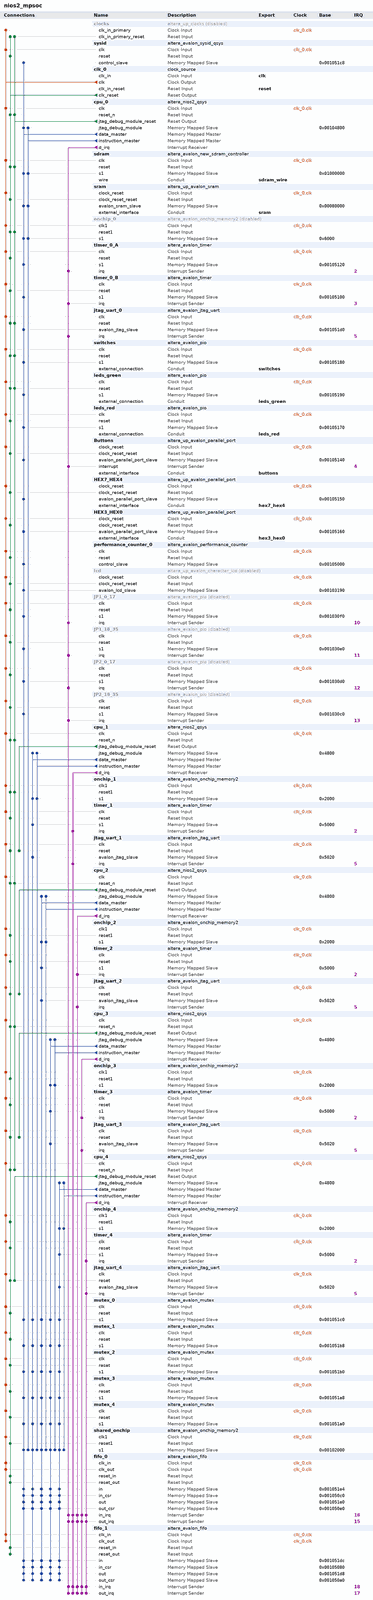
[diagram p0: system contents, whole]
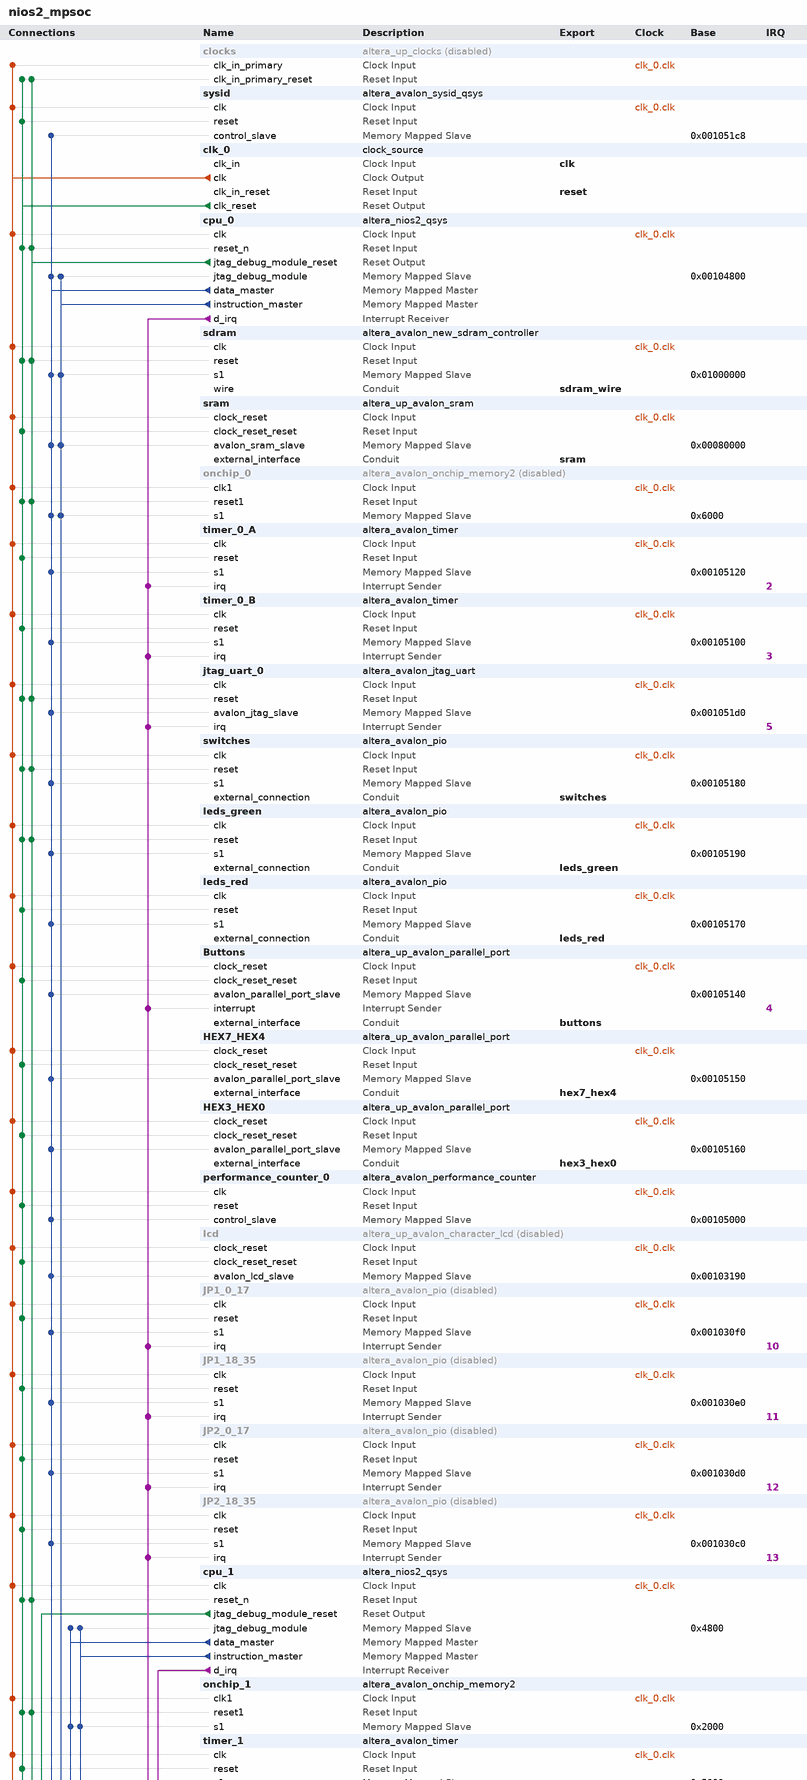
[diagram p1: system contents, upper part]
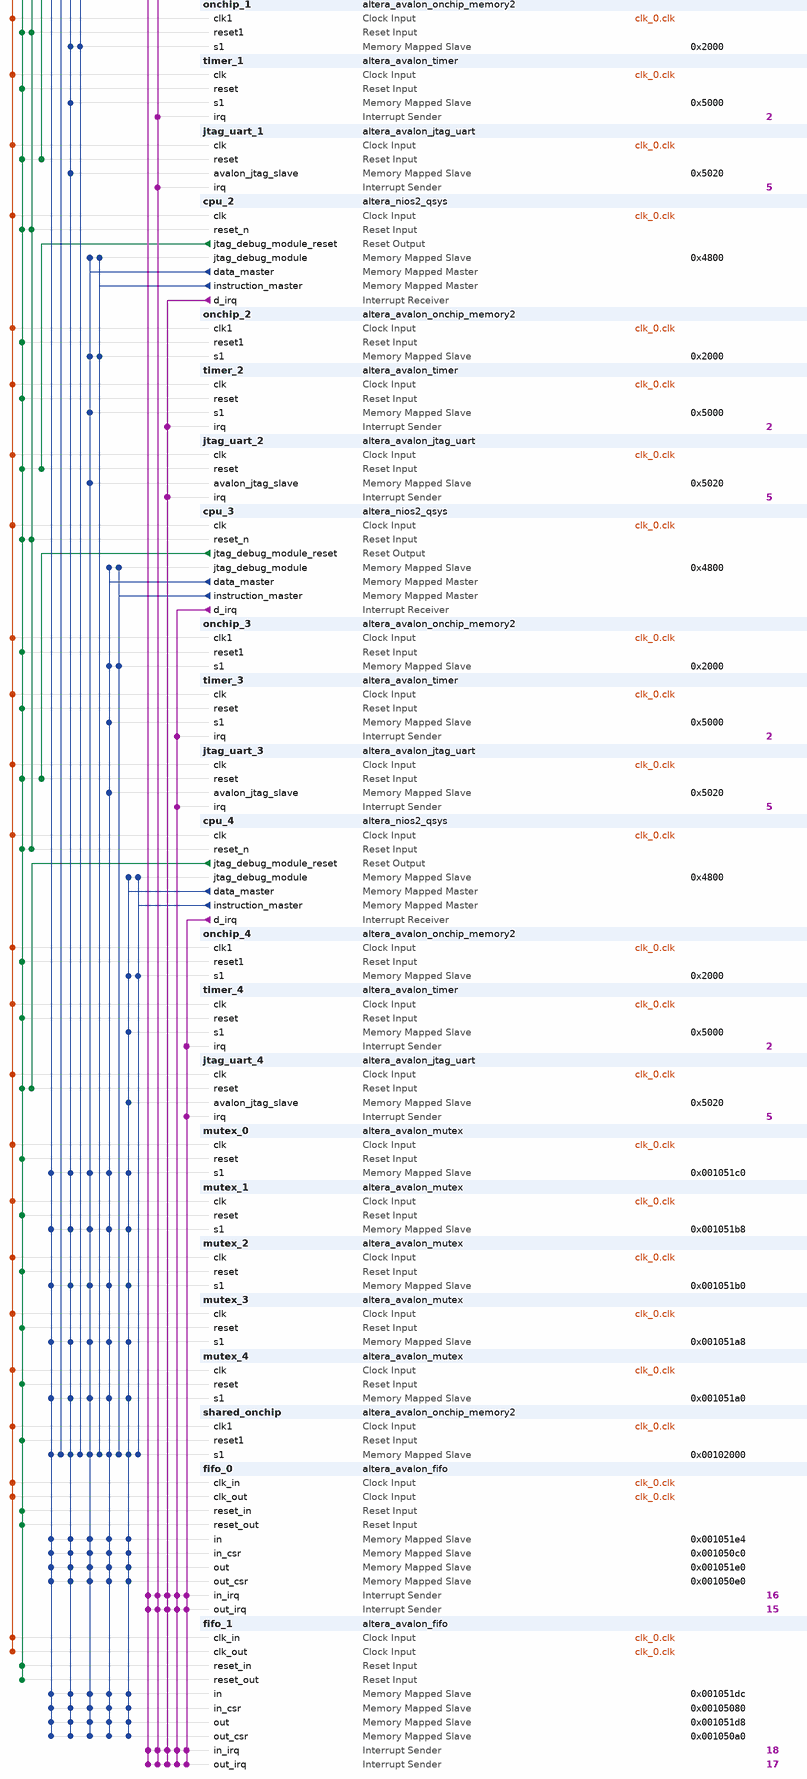
[diagram p2: system contents, lower part]
# Platform Designer (Qsys) system nios2_mpsoc, Cyclone IV E EP4CE115F29C7
# Parameters at their usual value, and those the tool derives, are not listed.
package require -exact qsys 13.0.1.99.2
create_system nios2_mpsoc
set_project_property DEVICE_FAMILY {Cyclone IV E}
set_project_property DEVICE EP4CE115F29C7

add_instance clocks altera_up_clocks 13.0
set_instance_property clocks ENABLED false
set_instance_parameter_value clocks board DE2
set_instance_parameter_value clocks vga_clk false
set_instance_parameter_value clocks audio_clk false
set_instance_parameter_value clocks audio_clk_freq 12.288

add_instance sysid altera_avalon_sysid_qsys 13.0
set_instance_parameter_value sysid id 538186246

add_instance clk_0 clock_source 13.0
set_instance_parameter_value clk_0 clockFrequency 50000000

add_instance cpu_0 altera_nios2_qsys 13.0
set_instance_parameter_value cpu_0 resetSlave sram.avalon_sram_slave
set_instance_parameter_value cpu_0 mmu_TLBMissExcSlave None
set_instance_parameter_value cpu_0 exceptionSlave sram.avalon_sram_slave
set_instance_parameter_value cpu_0 breakSlave cpu_0.jtag_debug_module
set_instance_parameter_value cpu_0 impl Tiny
set_instance_parameter_value cpu_0 icache_size 4096

add_instance sdram altera_avalon_new_sdram_controller 13.0.1.99.2
set_instance_parameter_value sdram TAC 5.5
set_instance_parameter_value sdram TRCD 20.0
set_instance_parameter_value sdram TRP 20.0
set_instance_parameter_value sdram casLatency 3
set_instance_parameter_value sdram columnWidth 8
set_instance_parameter_value sdram dataWidth 16
set_instance_parameter_value sdram generateSimulationModel false
set_instance_parameter_value sdram model single_Micron_MT48LC4M32B2_7_chip
set_instance_parameter_value sdram numberOfBanks 4
set_instance_parameter_value sdram numberOfChipSelects 1
set_instance_parameter_value sdram powerUpDelay 100.0
set_instance_parameter_value sdram refreshPeriod 15.625
set_instance_parameter_value sdram rowWidth 12

add_instance sram altera_up_avalon_sram 13.0
set_instance_parameter_value sram board DE2
set_instance_parameter_value sram pixel_buffer false

add_instance onchip_0 altera_avalon_onchip_memory2 13.0.1.99.2
set_instance_property onchip_0 ENABLED false
set_instance_parameter_value onchip_0 dataWidth 32
set_instance_parameter_value onchip_0 dualPort false
set_instance_parameter_value onchip_0 initMemContent true
set_instance_parameter_value onchip_0 initializationFileName onchip_mem.hex
set_instance_parameter_value onchip_0 memorySize 8192

add_instance timer_0_A altera_avalon_timer 13.0.1.99.2
set_instance_parameter_value timer_0_A period 1
set_instance_parameter_value timer_0_A periodUnits MSEC

add_instance timer_0_B altera_avalon_timer 13.0.1.99.2
set_instance_parameter_value timer_0_B period 1
set_instance_parameter_value timer_0_B periodUnits MSEC

add_instance jtag_uart_0 altera_avalon_jtag_uart 13.0.1.99.2
set_instance_parameter_value jtag_uart_0 simInteractiveOptions NO_INTERACTIVE_WINDOWS
set_instance_parameter_value jtag_uart_0 useRegistersForReadBuffer true
set_instance_parameter_value jtag_uart_0 useRegistersForWriteBuffer true

add_instance switches altera_avalon_pio 13.0.1.99.2
set_instance_parameter_value switches direction Input
set_instance_parameter_value switches width 18

add_instance leds_green altera_avalon_pio 13.0.1.99.2
set_instance_parameter_value leds_green direction Output
set_instance_parameter_value leds_green width 8

add_instance leds_red altera_avalon_pio 13.0.1.99.2
set_instance_parameter_value leds_red direction Output
set_instance_parameter_value leds_red width 18

add_instance Buttons altera_up_avalon_parallel_port 13.0
set_instance_parameter_value Buttons board DE2
set_instance_parameter_value Buttons preset Pushbuttons
set_instance_parameter_value Buttons capture true
set_instance_parameter_value Buttons edge Rising
set_instance_parameter_value Buttons irq true

add_instance HEX7_HEX4 altera_up_avalon_parallel_port 13.0
set_instance_parameter_value HEX7_HEX4 board DE2
set_instance_parameter_value HEX7_HEX4 preset {Seven Segment Displays}
set_instance_parameter_value HEX7_HEX4 sevensegs {7 to 4}
set_instance_parameter_value HEX7_HEX4 capture false
set_instance_parameter_value HEX7_HEX4 edge Rising
set_instance_parameter_value HEX7_HEX4 irq false

add_instance HEX3_HEX0 altera_up_avalon_parallel_port 13.0
set_instance_parameter_value HEX3_HEX0 board DE2
set_instance_parameter_value HEX3_HEX0 preset {Seven Segment Displays}
set_instance_parameter_value HEX3_HEX0 capture false
set_instance_parameter_value HEX3_HEX0 edge Rising
set_instance_parameter_value HEX3_HEX0 irq false

add_instance performance_counter_0 altera_avalon_performance_counter 13.0.1.99.2
set_instance_parameter_value performance_counter_0 numberOfSections 5

add_instance lcd altera_up_avalon_character_lcd 13.0
set_instance_property lcd ENABLED false
set_instance_parameter_value lcd cursor Both

add_instance JP1_0_17 altera_avalon_pio 13.0.1.99.2
set_instance_property JP1_0_17 ENABLED false
set_instance_parameter_value JP1_0_17 bitClearingEdgeCapReg true
set_instance_parameter_value JP1_0_17 captureEdge true
set_instance_parameter_value JP1_0_17 direction Bidir
set_instance_parameter_value JP1_0_17 generateIRQ true
set_instance_parameter_value JP1_0_17 irqType EDGE
set_instance_parameter_value JP1_0_17 width 18

add_instance JP1_18_35 altera_avalon_pio 13.0.1.99.2
set_instance_property JP1_18_35 ENABLED false
set_instance_parameter_value JP1_18_35 bitClearingEdgeCapReg true
set_instance_parameter_value JP1_18_35 captureEdge true
set_instance_parameter_value JP1_18_35 direction Bidir
set_instance_parameter_value JP1_18_35 generateIRQ true
set_instance_parameter_value JP1_18_35 irqType EDGE
set_instance_parameter_value JP1_18_35 width 18

add_instance JP2_0_17 altera_avalon_pio 13.0.1.99.2
set_instance_property JP2_0_17 ENABLED false
set_instance_parameter_value JP2_0_17 bitClearingEdgeCapReg true
set_instance_parameter_value JP2_0_17 captureEdge true
set_instance_parameter_value JP2_0_17 direction Bidir
set_instance_parameter_value JP2_0_17 generateIRQ true
set_instance_parameter_value JP2_0_17 irqType EDGE
set_instance_parameter_value JP2_0_17 width 18

add_instance JP2_18_35 altera_avalon_pio 13.0.1.99.2
set_instance_property JP2_18_35 ENABLED false
set_instance_parameter_value JP2_18_35 bitClearingEdgeCapReg true
set_instance_parameter_value JP2_18_35 captureEdge true
set_instance_parameter_value JP2_18_35 direction Bidir
set_instance_parameter_value JP2_18_35 generateIRQ true
set_instance_parameter_value JP2_18_35 irqType EDGE
set_instance_parameter_value JP2_18_35 width 18

add_instance cpu_1 altera_nios2_qsys 13.0
set_instance_parameter_value cpu_1 cpuID 1
set_instance_parameter_value cpu_1 resetSlave onchip_1.s1
set_instance_parameter_value cpu_1 mmu_TLBMissExcSlave None
set_instance_parameter_value cpu_1 exceptionSlave onchip_1.s1
set_instance_parameter_value cpu_1 breakSlave cpu_1.jtag_debug_module
set_instance_parameter_value cpu_1 impl Tiny
set_instance_parameter_value cpu_1 icache_size 4096

add_instance onchip_1 altera_avalon_onchip_memory2 13.0.1.99.2
set_instance_parameter_value onchip_1 dataWidth 32
set_instance_parameter_value onchip_1 dualPort false
set_instance_parameter_value onchip_1 initMemContent true
set_instance_parameter_value onchip_1 initializationFileName onchip_mem.hex
set_instance_parameter_value onchip_1 memorySize 8192

add_instance timer_1 altera_avalon_timer 13.0.1.99.2
set_instance_parameter_value timer_1 period 1
set_instance_parameter_value timer_1 periodUnits MSEC

add_instance jtag_uart_1 altera_avalon_jtag_uart 13.0.1.99.2
set_instance_parameter_value jtag_uart_1 simInteractiveOptions NO_INTERACTIVE_WINDOWS
set_instance_parameter_value jtag_uart_1 useRegistersForReadBuffer true
set_instance_parameter_value jtag_uart_1 useRegistersForWriteBuffer true

add_instance cpu_2 altera_nios2_qsys 13.0
set_instance_parameter_value cpu_2 cpuID 16
set_instance_parameter_value cpu_2 resetSlave onchip_2.s1
set_instance_parameter_value cpu_2 mmu_TLBMissExcSlave None
set_instance_parameter_value cpu_2 exceptionSlave onchip_2.s1
set_instance_parameter_value cpu_2 breakSlave cpu_2.jtag_debug_module
set_instance_parameter_value cpu_2 impl Tiny
set_instance_parameter_value cpu_2 icache_size 4096

add_instance onchip_2 altera_avalon_onchip_memory2 13.0.1.99.2
set_instance_parameter_value onchip_2 dataWidth 32
set_instance_parameter_value onchip_2 dualPort false
set_instance_parameter_value onchip_2 initMemContent true
set_instance_parameter_value onchip_2 initializationFileName onchip_mem.hex
set_instance_parameter_value onchip_2 memorySize 8192

add_instance timer_2 altera_avalon_timer 13.0.1.99.2
set_instance_parameter_value timer_2 period 1
set_instance_parameter_value timer_2 periodUnits MSEC

add_instance jtag_uart_2 altera_avalon_jtag_uart 13.0.1.99.2
set_instance_parameter_value jtag_uart_2 simInteractiveOptions NO_INTERACTIVE_WINDOWS
set_instance_parameter_value jtag_uart_2 useRegistersForReadBuffer true
set_instance_parameter_value jtag_uart_2 useRegistersForWriteBuffer true

add_instance cpu_3 altera_nios2_qsys 13.0
set_instance_parameter_value cpu_3 cpuID 17
set_instance_parameter_value cpu_3 resetSlave onchip_3.s1
set_instance_parameter_value cpu_3 mmu_TLBMissExcSlave None
set_instance_parameter_value cpu_3 exceptionSlave onchip_3.s1
set_instance_parameter_value cpu_3 breakSlave cpu_3.jtag_debug_module
set_instance_parameter_value cpu_3 impl Tiny
set_instance_parameter_value cpu_3 icache_size 4096

add_instance onchip_3 altera_avalon_onchip_memory2 13.0.1.99.2
set_instance_parameter_value onchip_3 dataWidth 32
set_instance_parameter_value onchip_3 dualPort false
set_instance_parameter_value onchip_3 initMemContent true
set_instance_parameter_value onchip_3 initializationFileName onchip_mem.hex
set_instance_parameter_value onchip_3 memorySize 8192

add_instance timer_3 altera_avalon_timer 13.0.1.99.2
set_instance_parameter_value timer_3 period 1
set_instance_parameter_value timer_3 periodUnits MSEC

add_instance jtag_uart_3 altera_avalon_jtag_uart 13.0.1.99.2
set_instance_parameter_value jtag_uart_3 simInteractiveOptions NO_INTERACTIVE_WINDOWS
set_instance_parameter_value jtag_uart_3 useRegistersForReadBuffer true
set_instance_parameter_value jtag_uart_3 useRegistersForWriteBuffer true

add_instance cpu_4 altera_nios2_qsys 13.0
set_instance_parameter_value cpu_4 cpuID 256
set_instance_parameter_value cpu_4 resetSlave onchip_4.s1
set_instance_parameter_value cpu_4 mmu_TLBMissExcSlave None
set_instance_parameter_value cpu_4 exceptionSlave onchip_4.s1
set_instance_parameter_value cpu_4 breakSlave cpu_4.jtag_debug_module
set_instance_parameter_value cpu_4 impl Tiny
set_instance_parameter_value cpu_4 icache_size 4096

add_instance onchip_4 altera_avalon_onchip_memory2 13.0.1.99.2
set_instance_parameter_value onchip_4 dataWidth 32
set_instance_parameter_value onchip_4 dualPort false
set_instance_parameter_value onchip_4 initMemContent true
set_instance_parameter_value onchip_4 initializationFileName onchip_mem.hex
set_instance_parameter_value onchip_4 memorySize 8192

add_instance timer_4 altera_avalon_timer 13.0.1.99.2
set_instance_parameter_value timer_4 period 1
set_instance_parameter_value timer_4 periodUnits MSEC

add_instance jtag_uart_4 altera_avalon_jtag_uart 13.0.1.99.2
set_instance_parameter_value jtag_uart_4 simInteractiveOptions NO_INTERACTIVE_WINDOWS
set_instance_parameter_value jtag_uart_4 useRegistersForReadBuffer true
set_instance_parameter_value jtag_uart_4 useRegistersForWriteBuffer true

add_instance mutex_0 altera_avalon_mutex 13.0.1.99.2

add_instance mutex_1 altera_avalon_mutex 13.0.1.99.2

add_instance mutex_2 altera_avalon_mutex 13.0.1.99.2

add_instance mutex_3 altera_avalon_mutex 13.0.1.99.2

add_instance mutex_4 altera_avalon_mutex 13.0.1.99.2

add_instance shared_onchip altera_avalon_onchip_memory2 13.0.1.99.2
set_instance_parameter_value shared_onchip dataWidth 32
set_instance_parameter_value shared_onchip dualPort false
set_instance_parameter_value shared_onchip initMemContent true
set_instance_parameter_value shared_onchip initializationFileName onchip_mem.hex
set_instance_parameter_value shared_onchip memorySize 8192

add_instance fifo_0 altera_avalon_fifo 13.0.1.99.2
set_instance_parameter_value fifo_0 bitsPerSymbol 16
set_instance_parameter_value fifo_0 channelWidth 8
set_instance_parameter_value fifo_0 errorWidth 8
set_instance_parameter_value fifo_0 fifoDepth 16
set_instance_parameter_value fifo_0 fifoInputInterfaceOptions AVALONMM_WRITE
set_instance_parameter_value fifo_0 fifoOutputInterfaceOptions AVALONMM_READ
set_instance_parameter_value fifo_0 singleClockMode false
set_instance_parameter_value fifo_0 symbolsPerBeat 2
set_instance_parameter_value fifo_0 useIRQ true
set_instance_parameter_value fifo_0 usePacket true
set_instance_parameter_value fifo_0 useReadControl true

add_instance fifo_1 altera_avalon_fifo 13.0.1.99.2
set_instance_parameter_value fifo_1 bitsPerSymbol 16
set_instance_parameter_value fifo_1 channelWidth 8
set_instance_parameter_value fifo_1 errorWidth 8
set_instance_parameter_value fifo_1 fifoDepth 16
set_instance_parameter_value fifo_1 fifoInputInterfaceOptions AVALONMM_WRITE
set_instance_parameter_value fifo_1 fifoOutputInterfaceOptions AVALONMM_READ
set_instance_parameter_value fifo_1 singleClockMode false
set_instance_parameter_value fifo_1 symbolsPerBeat 2
set_instance_parameter_value fifo_1 useIRQ true
set_instance_parameter_value fifo_1 usePacket true
set_instance_parameter_value fifo_1 useReadControl true

# connections
add_connection clk_0.clk Buttons.clock_reset clock
add_connection clk_0.clk clocks.clk_in_primary clock
add_connection clk_0.clk cpu_0.clk clock
add_connection clk_0.clk cpu_1.clk clock
add_connection clk_0.clk cpu_2.clk clock
add_connection clk_0.clk cpu_3.clk clock
add_connection clk_0.clk cpu_4.clk clock
add_connection clk_0.clk fifo_0.clk_in clock
add_connection clk_0.clk fifo_0.clk_out clock
add_connection clk_0.clk fifo_1.clk_in clock
add_connection clk_0.clk fifo_1.clk_out clock
add_connection clk_0.clk HEX3_HEX0.clock_reset clock
add_connection clk_0.clk HEX7_HEX4.clock_reset clock
add_connection clk_0.clk JP1_0_17.clk clock
add_connection clk_0.clk JP1_18_35.clk clock
add_connection clk_0.clk JP2_0_17.clk clock
add_connection clk_0.clk JP2_18_35.clk clock
add_connection clk_0.clk jtag_uart_0.clk clock
add_connection clk_0.clk jtag_uart_1.clk clock
add_connection clk_0.clk jtag_uart_2.clk clock
add_connection clk_0.clk jtag_uart_3.clk clock
add_connection clk_0.clk jtag_uart_4.clk clock
add_connection clk_0.clk lcd.clock_reset clock
add_connection clk_0.clk leds_green.clk clock
add_connection clk_0.clk leds_red.clk clock
add_connection clk_0.clk mutex_0.clk clock
add_connection clk_0.clk mutex_1.clk clock
add_connection clk_0.clk mutex_2.clk clock
add_connection clk_0.clk mutex_3.clk clock
add_connection clk_0.clk mutex_4.clk clock
add_connection clk_0.clk onchip_0.clk1 clock
add_connection clk_0.clk onchip_1.clk1 clock
add_connection clk_0.clk onchip_2.clk1 clock
add_connection clk_0.clk onchip_3.clk1 clock
add_connection clk_0.clk onchip_4.clk1 clock
add_connection clk_0.clk performance_counter_0.clk clock
add_connection clk_0.clk sdram.clk clock
add_connection clk_0.clk shared_onchip.clk1 clock
add_connection clk_0.clk sram.clock_reset clock
add_connection clk_0.clk switches.clk clock
add_connection clk_0.clk sysid.clk clock
add_connection clk_0.clk timer_0_A.clk clock
add_connection clk_0.clk timer_0_B.clk clock
add_connection clk_0.clk timer_1.clk clock
add_connection clk_0.clk timer_2.clk clock
add_connection clk_0.clk timer_3.clk clock
add_connection clk_0.clk timer_4.clk clock
add_connection clk_0.clk_reset Buttons.clock_reset_reset reset
add_connection clk_0.clk_reset clocks.clk_in_primary_reset reset
add_connection clk_0.clk_reset cpu_0.reset_n reset
add_connection clk_0.clk_reset cpu_1.reset_n reset
add_connection clk_0.clk_reset cpu_2.reset_n reset
add_connection clk_0.clk_reset cpu_3.reset_n reset
add_connection clk_0.clk_reset cpu_4.reset_n reset
add_connection clk_0.clk_reset fifo_0.reset_in reset
add_connection clk_0.clk_reset fifo_0.reset_out reset
add_connection clk_0.clk_reset fifo_1.reset_in reset
add_connection clk_0.clk_reset fifo_1.reset_out reset
add_connection clk_0.clk_reset HEX3_HEX0.clock_reset_reset reset
add_connection clk_0.clk_reset HEX7_HEX4.clock_reset_reset reset
add_connection clk_0.clk_reset JP1_0_17.reset reset
add_connection clk_0.clk_reset JP1_18_35.reset reset
add_connection clk_0.clk_reset JP2_0_17.reset reset
add_connection clk_0.clk_reset JP2_18_35.reset reset
add_connection clk_0.clk_reset jtag_uart_0.reset reset
add_connection clk_0.clk_reset jtag_uart_1.reset reset
add_connection clk_0.clk_reset jtag_uart_2.reset reset
add_connection clk_0.clk_reset jtag_uart_3.reset reset
add_connection clk_0.clk_reset jtag_uart_4.reset reset
add_connection clk_0.clk_reset lcd.clock_reset_reset reset
add_connection clk_0.clk_reset leds_green.reset reset
add_connection clk_0.clk_reset leds_red.reset reset
add_connection clk_0.clk_reset mutex_0.reset reset
add_connection clk_0.clk_reset mutex_1.reset reset
add_connection clk_0.clk_reset mutex_2.reset reset
add_connection clk_0.clk_reset mutex_3.reset reset
add_connection clk_0.clk_reset mutex_4.reset reset
add_connection clk_0.clk_reset onchip_0.reset1 reset
add_connection clk_0.clk_reset onchip_1.reset1 reset
add_connection clk_0.clk_reset onchip_2.reset1 reset
add_connection clk_0.clk_reset onchip_3.reset1 reset
add_connection clk_0.clk_reset onchip_4.reset1 reset
add_connection clk_0.clk_reset performance_counter_0.reset reset
add_connection clk_0.clk_reset sdram.reset reset
add_connection clk_0.clk_reset shared_onchip.reset1 reset
add_connection clk_0.clk_reset sram.clock_reset_reset reset
add_connection clk_0.clk_reset switches.reset reset
add_connection clk_0.clk_reset sysid.reset reset
add_connection clk_0.clk_reset timer_0_A.reset reset
add_connection clk_0.clk_reset timer_0_B.reset reset
add_connection clk_0.clk_reset timer_1.reset reset
add_connection clk_0.clk_reset timer_2.reset reset
add_connection clk_0.clk_reset timer_3.reset reset
add_connection clk_0.clk_reset timer_4.reset reset
add_connection cpu_0.jtag_debug_module_reset clocks.clk_in_primary_reset reset
add_connection cpu_0.jtag_debug_module_reset cpu_0.reset_n reset
add_connection cpu_0.jtag_debug_module_reset cpu_1.reset_n reset
add_connection cpu_0.jtag_debug_module_reset cpu_2.reset_n reset
add_connection cpu_0.jtag_debug_module_reset cpu_3.reset_n reset
add_connection cpu_0.jtag_debug_module_reset cpu_4.reset_n reset
add_connection cpu_0.jtag_debug_module_reset jtag_uart_0.reset reset
add_connection cpu_0.jtag_debug_module_reset leds_green.reset reset
add_connection cpu_0.jtag_debug_module_reset onchip_0.reset1 reset
add_connection cpu_0.jtag_debug_module_reset onchip_1.reset1 reset
add_connection cpu_0.jtag_debug_module_reset sdram.reset reset
add_connection cpu_0.jtag_debug_module_reset switches.reset reset
add_connection cpu_1.jtag_debug_module_reset jtag_uart_1.reset reset
add_connection cpu_2.jtag_debug_module_reset jtag_uart_2.reset reset
add_connection cpu_3.jtag_debug_module_reset jtag_uart_3.reset reset
add_connection cpu_4.jtag_debug_module_reset jtag_uart_4.reset reset
add_connection cpu_0.data_master Buttons.avalon_parallel_port_slave avalon
set_connection_parameter_value cpu_0.data_master/Buttons.avalon_parallel_port_slave baseAddress 0x00105140
add_connection cpu_0.data_master cpu_0.jtag_debug_module avalon
set_connection_parameter_value cpu_0.data_master/cpu_0.jtag_debug_module baseAddress 0x00104800
add_connection cpu_0.data_master fifo_0.in avalon
set_connection_parameter_value cpu_0.data_master/fifo_0.in baseAddress 0x001051e4
add_connection cpu_0.data_master fifo_0.in_csr avalon
set_connection_parameter_value cpu_0.data_master/fifo_0.in_csr baseAddress 0x001050c0
add_connection cpu_0.data_master fifo_0.out avalon
set_connection_parameter_value cpu_0.data_master/fifo_0.out baseAddress 0x001051e0
add_connection cpu_0.data_master fifo_0.out_csr avalon
set_connection_parameter_value cpu_0.data_master/fifo_0.out_csr baseAddress 0x001050e0
add_connection cpu_0.data_master fifo_1.in avalon
set_connection_parameter_value cpu_0.data_master/fifo_1.in baseAddress 0x001051dc
add_connection cpu_0.data_master fifo_1.in_csr avalon
set_connection_parameter_value cpu_0.data_master/fifo_1.in_csr baseAddress 0x00105080
add_connection cpu_0.data_master fifo_1.out avalon
set_connection_parameter_value cpu_0.data_master/fifo_1.out baseAddress 0x001051d8
add_connection cpu_0.data_master fifo_1.out_csr avalon
set_connection_parameter_value cpu_0.data_master/fifo_1.out_csr baseAddress 0x001050a0
add_connection cpu_0.data_master HEX3_HEX0.avalon_parallel_port_slave avalon
set_connection_parameter_value cpu_0.data_master/HEX3_HEX0.avalon_parallel_port_slave baseAddress 0x00105160
add_connection cpu_0.data_master HEX7_HEX4.avalon_parallel_port_slave avalon
set_connection_parameter_value cpu_0.data_master/HEX7_HEX4.avalon_parallel_port_slave baseAddress 0x00105150
add_connection cpu_0.data_master JP1_0_17.s1 avalon
set_connection_parameter_value cpu_0.data_master/JP1_0_17.s1 baseAddress 0x001030f0
add_connection cpu_0.data_master JP1_18_35.s1 avalon
set_connection_parameter_value cpu_0.data_master/JP1_18_35.s1 baseAddress 0x001030e0
add_connection cpu_0.data_master JP2_0_17.s1 avalon
set_connection_parameter_value cpu_0.data_master/JP2_0_17.s1 baseAddress 0x001030d0
add_connection cpu_0.data_master JP2_18_35.s1 avalon
set_connection_parameter_value cpu_0.data_master/JP2_18_35.s1 baseAddress 0x001030c0
add_connection cpu_0.data_master jtag_uart_0.avalon_jtag_slave avalon
set_connection_parameter_value cpu_0.data_master/jtag_uart_0.avalon_jtag_slave baseAddress 0x001051d0
add_connection cpu_0.data_master lcd.avalon_lcd_slave avalon
set_connection_parameter_value cpu_0.data_master/lcd.avalon_lcd_slave baseAddress 0x00103190
add_connection cpu_0.data_master leds_green.s1 avalon
set_connection_parameter_value cpu_0.data_master/leds_green.s1 baseAddress 0x00105190
add_connection cpu_0.data_master leds_red.s1 avalon
set_connection_parameter_value cpu_0.data_master/leds_red.s1 baseAddress 0x00105170
add_connection cpu_0.data_master mutex_0.s1 avalon
set_connection_parameter_value cpu_0.data_master/mutex_0.s1 baseAddress 0x001051c0
add_connection cpu_0.data_master mutex_1.s1 avalon
set_connection_parameter_value cpu_0.data_master/mutex_1.s1 baseAddress 0x001051b8
add_connection cpu_0.data_master mutex_2.s1 avalon
set_connection_parameter_value cpu_0.data_master/mutex_2.s1 baseAddress 0x001051b0
add_connection cpu_0.data_master mutex_3.s1 avalon
set_connection_parameter_value cpu_0.data_master/mutex_3.s1 baseAddress 0x001051a8
add_connection cpu_0.data_master mutex_4.s1 avalon
set_connection_parameter_value cpu_0.data_master/mutex_4.s1 baseAddress 0x001051a0
add_connection cpu_0.data_master onchip_0.s1 avalon
set_connection_parameter_value cpu_0.data_master/onchip_0.s1 baseAddress 0x6000
add_connection cpu_0.data_master performance_counter_0.control_slave avalon
set_connection_parameter_value cpu_0.data_master/performance_counter_0.control_slave baseAddress 0x00105000
add_connection cpu_0.data_master sdram.s1 avalon
set_connection_parameter_value cpu_0.data_master/sdram.s1 baseAddress 0x01000000
add_connection cpu_0.data_master shared_onchip.s1 avalon
set_connection_parameter_value cpu_0.data_master/shared_onchip.s1 baseAddress 0x00102000
add_connection cpu_0.data_master sram.avalon_sram_slave avalon
set_connection_parameter_value cpu_0.data_master/sram.avalon_sram_slave baseAddress 0x00080000
add_connection cpu_0.data_master switches.s1 avalon
set_connection_parameter_value cpu_0.data_master/switches.s1 baseAddress 0x00105180
add_connection cpu_0.data_master sysid.control_slave avalon
set_connection_parameter_value cpu_0.data_master/sysid.control_slave baseAddress 0x001051c8
add_connection cpu_0.data_master timer_0_A.s1 avalon
set_connection_parameter_value cpu_0.data_master/timer_0_A.s1 baseAddress 0x00105120
add_connection cpu_0.data_master timer_0_B.s1 avalon
set_connection_parameter_value cpu_0.data_master/timer_0_B.s1 baseAddress 0x00105100
add_connection cpu_0.instruction_master cpu_0.jtag_debug_module avalon
set_connection_parameter_value cpu_0.instruction_master/cpu_0.jtag_debug_module baseAddress 0x00104800
add_connection cpu_0.instruction_master onchip_0.s1 avalon
set_connection_parameter_value cpu_0.instruction_master/onchip_0.s1 baseAddress 0x6000
add_connection cpu_0.instruction_master sdram.s1 avalon
set_connection_parameter_value cpu_0.instruction_master/sdram.s1 baseAddress 0x01000000
add_connection cpu_0.instruction_master shared_onchip.s1 avalon
set_connection_parameter_value cpu_0.instruction_master/shared_onchip.s1 baseAddress 0x00102000
add_connection cpu_0.instruction_master sram.avalon_sram_slave avalon
set_connection_parameter_value cpu_0.instruction_master/sram.avalon_sram_slave baseAddress 0x00080000
add_connection cpu_1.data_master cpu_1.jtag_debug_module avalon
set_connection_parameter_value cpu_1.data_master/cpu_1.jtag_debug_module baseAddress 0x4800
add_connection cpu_1.data_master fifo_0.in avalon
set_connection_parameter_value cpu_1.data_master/fifo_0.in baseAddress 0x001051e4
add_connection cpu_1.data_master fifo_0.in_csr avalon
set_connection_parameter_value cpu_1.data_master/fifo_0.in_csr baseAddress 0x001050c0
add_connection cpu_1.data_master fifo_0.out avalon
set_connection_parameter_value cpu_1.data_master/fifo_0.out baseAddress 0x001051e0
add_connection cpu_1.data_master fifo_0.out_csr avalon
set_connection_parameter_value cpu_1.data_master/fifo_0.out_csr baseAddress 0x001050e0
add_connection cpu_1.data_master fifo_1.in avalon
set_connection_parameter_value cpu_1.data_master/fifo_1.in baseAddress 0x001051dc
add_connection cpu_1.data_master fifo_1.in_csr avalon
set_connection_parameter_value cpu_1.data_master/fifo_1.in_csr baseAddress 0x00105080
add_connection cpu_1.data_master fifo_1.out avalon
set_connection_parameter_value cpu_1.data_master/fifo_1.out baseAddress 0x001051d8
add_connection cpu_1.data_master fifo_1.out_csr avalon
set_connection_parameter_value cpu_1.data_master/fifo_1.out_csr baseAddress 0x001050a0
add_connection cpu_1.data_master jtag_uart_1.avalon_jtag_slave avalon
set_connection_parameter_value cpu_1.data_master/jtag_uart_1.avalon_jtag_slave baseAddress 0x5020
add_connection cpu_1.data_master mutex_0.s1 avalon
set_connection_parameter_value cpu_1.data_master/mutex_0.s1 baseAddress 0x001051c0
add_connection cpu_1.data_master mutex_1.s1 avalon
set_connection_parameter_value cpu_1.data_master/mutex_1.s1 baseAddress 0x001051b8
add_connection cpu_1.data_master mutex_2.s1 avalon
set_connection_parameter_value cpu_1.data_master/mutex_2.s1 baseAddress 0x001051b0
add_connection cpu_1.data_master mutex_3.s1 avalon
set_connection_parameter_value cpu_1.data_master/mutex_3.s1 baseAddress 0x001051a8
add_connection cpu_1.data_master mutex_4.s1 avalon
set_connection_parameter_value cpu_1.data_master/mutex_4.s1 baseAddress 0x001051a0
add_connection cpu_1.data_master onchip_1.s1 avalon
set_connection_parameter_value cpu_1.data_master/onchip_1.s1 baseAddress 0x2000
add_connection cpu_1.data_master shared_onchip.s1 avalon
set_connection_parameter_value cpu_1.data_master/shared_onchip.s1 baseAddress 0x00102000
add_connection cpu_1.data_master timer_1.s1 avalon
set_connection_parameter_value cpu_1.data_master/timer_1.s1 baseAddress 0x5000
add_connection cpu_1.instruction_master cpu_1.jtag_debug_module avalon
set_connection_parameter_value cpu_1.instruction_master/cpu_1.jtag_debug_module baseAddress 0x4800
add_connection cpu_1.instruction_master onchip_1.s1 avalon
set_connection_parameter_value cpu_1.instruction_master/onchip_1.s1 baseAddress 0x2000
add_connection cpu_1.instruction_master shared_onchip.s1 avalon
set_connection_parameter_value cpu_1.instruction_master/shared_onchip.s1 baseAddress 0x00102000
add_connection cpu_2.data_master cpu_2.jtag_debug_module avalon
set_connection_parameter_value cpu_2.data_master/cpu_2.jtag_debug_module baseAddress 0x4800
add_connection cpu_2.data_master fifo_0.in avalon
set_connection_parameter_value cpu_2.data_master/fifo_0.in baseAddress 0x001051e4
add_connection cpu_2.data_master fifo_0.in_csr avalon
set_connection_parameter_value cpu_2.data_master/fifo_0.in_csr baseAddress 0x001050c0
add_connection cpu_2.data_master fifo_0.out avalon
set_connection_parameter_value cpu_2.data_master/fifo_0.out baseAddress 0x001051e0
add_connection cpu_2.data_master fifo_0.out_csr avalon
set_connection_parameter_value cpu_2.data_master/fifo_0.out_csr baseAddress 0x001050e0
add_connection cpu_2.data_master fifo_1.in avalon
set_connection_parameter_value cpu_2.data_master/fifo_1.in baseAddress 0x001051dc
add_connection cpu_2.data_master fifo_1.in_csr avalon
set_connection_parameter_value cpu_2.data_master/fifo_1.in_csr baseAddress 0x00105080
add_connection cpu_2.data_master fifo_1.out avalon
set_connection_parameter_value cpu_2.data_master/fifo_1.out baseAddress 0x001051d8
add_connection cpu_2.data_master fifo_1.out_csr avalon
set_connection_parameter_value cpu_2.data_master/fifo_1.out_csr baseAddress 0x001050a0
add_connection cpu_2.data_master jtag_uart_2.avalon_jtag_slave avalon
set_connection_parameter_value cpu_2.data_master/jtag_uart_2.avalon_jtag_slave baseAddress 0x5020
add_connection cpu_2.data_master mutex_0.s1 avalon
set_connection_parameter_value cpu_2.data_master/mutex_0.s1 baseAddress 0x001051c0
add_connection cpu_2.data_master mutex_1.s1 avalon
set_connection_parameter_value cpu_2.data_master/mutex_1.s1 baseAddress 0x001051b8
add_connection cpu_2.data_master mutex_2.s1 avalon
set_connection_parameter_value cpu_2.data_master/mutex_2.s1 baseAddress 0x001051b0
add_connection cpu_2.data_master mutex_3.s1 avalon
set_connection_parameter_value cpu_2.data_master/mutex_3.s1 baseAddress 0x001051a8
add_connection cpu_2.data_master mutex_4.s1 avalon
set_connection_parameter_value cpu_2.data_master/mutex_4.s1 baseAddress 0x001051a0
add_connection cpu_2.data_master onchip_2.s1 avalon
set_connection_parameter_value cpu_2.data_master/onchip_2.s1 baseAddress 0x2000
add_connection cpu_2.data_master shared_onchip.s1 avalon
set_connection_parameter_value cpu_2.data_master/shared_onchip.s1 baseAddress 0x00102000
add_connection cpu_2.data_master timer_2.s1 avalon
set_connection_parameter_value cpu_2.data_master/timer_2.s1 baseAddress 0x5000
add_connection cpu_2.instruction_master cpu_2.jtag_debug_module avalon
set_connection_parameter_value cpu_2.instruction_master/cpu_2.jtag_debug_module baseAddress 0x4800
add_connection cpu_2.instruction_master onchip_2.s1 avalon
set_connection_parameter_value cpu_2.instruction_master/onchip_2.s1 baseAddress 0x2000
add_connection cpu_2.instruction_master shared_onchip.s1 avalon
set_connection_parameter_value cpu_2.instruction_master/shared_onchip.s1 baseAddress 0x00102000
add_connection cpu_3.data_master cpu_3.jtag_debug_module avalon
set_connection_parameter_value cpu_3.data_master/cpu_3.jtag_debug_module baseAddress 0x4800
add_connection cpu_3.data_master fifo_0.in avalon
set_connection_parameter_value cpu_3.data_master/fifo_0.in baseAddress 0x001051e4
add_connection cpu_3.data_master fifo_0.in_csr avalon
set_connection_parameter_value cpu_3.data_master/fifo_0.in_csr baseAddress 0x001050c0
add_connection cpu_3.data_master fifo_0.out avalon
set_connection_parameter_value cpu_3.data_master/fifo_0.out baseAddress 0x001051e0
add_connection cpu_3.data_master fifo_0.out_csr avalon
set_connection_parameter_value cpu_3.data_master/fifo_0.out_csr baseAddress 0x001050e0
add_connection cpu_3.data_master fifo_1.in avalon
set_connection_parameter_value cpu_3.data_master/fifo_1.in baseAddress 0x001051dc
add_connection cpu_3.data_master fifo_1.in_csr avalon
set_connection_parameter_value cpu_3.data_master/fifo_1.in_csr baseAddress 0x00105080
add_connection cpu_3.data_master fifo_1.out avalon
set_connection_parameter_value cpu_3.data_master/fifo_1.out baseAddress 0x001051d8
add_connection cpu_3.data_master fifo_1.out_csr avalon
set_connection_parameter_value cpu_3.data_master/fifo_1.out_csr baseAddress 0x001050a0
add_connection cpu_3.data_master jtag_uart_3.avalon_jtag_slave avalon
set_connection_parameter_value cpu_3.data_master/jtag_uart_3.avalon_jtag_slave baseAddress 0x5020
add_connection cpu_3.data_master mutex_0.s1 avalon
set_connection_parameter_value cpu_3.data_master/mutex_0.s1 baseAddress 0x001051c0
add_connection cpu_3.data_master mutex_1.s1 avalon
set_connection_parameter_value cpu_3.data_master/mutex_1.s1 baseAddress 0x001051b8
add_connection cpu_3.data_master mutex_2.s1 avalon
set_connection_parameter_value cpu_3.data_master/mutex_2.s1 baseAddress 0x001051b0
add_connection cpu_3.data_master mutex_3.s1 avalon
set_connection_parameter_value cpu_3.data_master/mutex_3.s1 baseAddress 0x001051a8
add_connection cpu_3.data_master mutex_4.s1 avalon
set_connection_parameter_value cpu_3.data_master/mutex_4.s1 baseAddress 0x001051a0
add_connection cpu_3.data_master onchip_3.s1 avalon
set_connection_parameter_value cpu_3.data_master/onchip_3.s1 baseAddress 0x2000
add_connection cpu_3.data_master shared_onchip.s1 avalon
set_connection_parameter_value cpu_3.data_master/shared_onchip.s1 baseAddress 0x00102000
add_connection cpu_3.data_master timer_3.s1 avalon
set_connection_parameter_value cpu_3.data_master/timer_3.s1 baseAddress 0x5000
add_connection cpu_3.instruction_master cpu_3.jtag_debug_module avalon
set_connection_parameter_value cpu_3.instruction_master/cpu_3.jtag_debug_module baseAddress 0x4800
add_connection cpu_3.instruction_master onchip_3.s1 avalon
set_connection_parameter_value cpu_3.instruction_master/onchip_3.s1 baseAddress 0x2000
add_connection cpu_3.instruction_master shared_onchip.s1 avalon
set_connection_parameter_value cpu_3.instruction_master/shared_onchip.s1 baseAddress 0x00102000
add_connection cpu_4.data_master cpu_4.jtag_debug_module avalon
set_connection_parameter_value cpu_4.data_master/cpu_4.jtag_debug_module baseAddress 0x4800
add_connection cpu_4.data_master fifo_0.in avalon
set_connection_parameter_value cpu_4.data_master/fifo_0.in baseAddress 0x001051e4
add_connection cpu_4.data_master fifo_0.in_csr avalon
set_connection_parameter_value cpu_4.data_master/fifo_0.in_csr baseAddress 0x001050c0
add_connection cpu_4.data_master fifo_0.out avalon
set_connection_parameter_value cpu_4.data_master/fifo_0.out baseAddress 0x001051e0
add_connection cpu_4.data_master fifo_0.out_csr avalon
set_connection_parameter_value cpu_4.data_master/fifo_0.out_csr baseAddress 0x001050e0
add_connection cpu_4.data_master fifo_1.in avalon
set_connection_parameter_value cpu_4.data_master/fifo_1.in baseAddress 0x001051dc
add_connection cpu_4.data_master fifo_1.in_csr avalon
set_connection_parameter_value cpu_4.data_master/fifo_1.in_csr baseAddress 0x00105080
add_connection cpu_4.data_master fifo_1.out avalon
set_connection_parameter_value cpu_4.data_master/fifo_1.out baseAddress 0x001051d8
add_connection cpu_4.data_master fifo_1.out_csr avalon
set_connection_parameter_value cpu_4.data_master/fifo_1.out_csr baseAddress 0x001050a0
add_connection cpu_4.data_master jtag_uart_4.avalon_jtag_slave avalon
set_connection_parameter_value cpu_4.data_master/jtag_uart_4.avalon_jtag_slave baseAddress 0x5020
add_connection cpu_4.data_master mutex_0.s1 avalon
set_connection_parameter_value cpu_4.data_master/mutex_0.s1 baseAddress 0x001051c0
add_connection cpu_4.data_master mutex_1.s1 avalon
set_connection_parameter_value cpu_4.data_master/mutex_1.s1 baseAddress 0x001051b8
add_connection cpu_4.data_master mutex_2.s1 avalon
set_connection_parameter_value cpu_4.data_master/mutex_2.s1 baseAddress 0x001051b0
add_connection cpu_4.data_master mutex_3.s1 avalon
set_connection_parameter_value cpu_4.data_master/mutex_3.s1 baseAddress 0x001051a8
add_connection cpu_4.data_master mutex_4.s1 avalon
set_connection_parameter_value cpu_4.data_master/mutex_4.s1 baseAddress 0x001051a0
add_connection cpu_4.data_master onchip_4.s1 avalon
set_connection_parameter_value cpu_4.data_master/onchip_4.s1 baseAddress 0x2000
add_connection cpu_4.data_master shared_onchip.s1 avalon
set_connection_parameter_value cpu_4.data_master/shared_onchip.s1 baseAddress 0x00102000
add_connection cpu_4.data_master timer_4.s1 avalon
set_connection_parameter_value cpu_4.data_master/timer_4.s1 baseAddress 0x5000
add_connection cpu_4.instruction_master cpu_4.jtag_debug_module avalon
set_connection_parameter_value cpu_4.instruction_master/cpu_4.jtag_debug_module baseAddress 0x4800
add_connection cpu_4.instruction_master onchip_4.s1 avalon
set_connection_parameter_value cpu_4.instruction_master/onchip_4.s1 baseAddress 0x2000
add_connection cpu_4.instruction_master shared_onchip.s1 avalon
set_connection_parameter_value cpu_4.instruction_master/shared_onchip.s1 baseAddress 0x00102000
add_connection cpu_0.d_irq Buttons.interrupt interrupt
set_connection_parameter_value cpu_0.d_irq/Buttons.interrupt irqNumber 4
add_connection cpu_0.d_irq fifo_0.in_irq interrupt
set_connection_parameter_value cpu_0.d_irq/fifo_0.in_irq irqNumber 16
add_connection cpu_0.d_irq fifo_0.out_irq interrupt
set_connection_parameter_value cpu_0.d_irq/fifo_0.out_irq irqNumber 15
add_connection cpu_0.d_irq fifo_1.in_irq interrupt
set_connection_parameter_value cpu_0.d_irq/fifo_1.in_irq irqNumber 18
add_connection cpu_0.d_irq fifo_1.out_irq interrupt
set_connection_parameter_value cpu_0.d_irq/fifo_1.out_irq irqNumber 17
add_connection cpu_0.d_irq JP1_0_17.irq interrupt
set_connection_parameter_value cpu_0.d_irq/JP1_0_17.irq irqNumber 10
add_connection cpu_0.d_irq JP1_18_35.irq interrupt
set_connection_parameter_value cpu_0.d_irq/JP1_18_35.irq irqNumber 11
add_connection cpu_0.d_irq JP2_0_17.irq interrupt
set_connection_parameter_value cpu_0.d_irq/JP2_0_17.irq irqNumber 12
add_connection cpu_0.d_irq JP2_18_35.irq interrupt
set_connection_parameter_value cpu_0.d_irq/JP2_18_35.irq irqNumber 13
add_connection cpu_0.d_irq jtag_uart_0.irq interrupt
set_connection_parameter_value cpu_0.d_irq/jtag_uart_0.irq irqNumber 5
add_connection cpu_0.d_irq timer_0_A.irq interrupt
set_connection_parameter_value cpu_0.d_irq/timer_0_A.irq irqNumber 2
add_connection cpu_0.d_irq timer_0_B.irq interrupt
set_connection_parameter_value cpu_0.d_irq/timer_0_B.irq irqNumber 3
add_connection cpu_1.d_irq fifo_0.in_irq interrupt
set_connection_parameter_value cpu_1.d_irq/fifo_0.in_irq irqNumber 16
add_connection cpu_1.d_irq fifo_0.out_irq interrupt
set_connection_parameter_value cpu_1.d_irq/fifo_0.out_irq irqNumber 15
add_connection cpu_1.d_irq fifo_1.in_irq interrupt
set_connection_parameter_value cpu_1.d_irq/fifo_1.in_irq irqNumber 18
add_connection cpu_1.d_irq fifo_1.out_irq interrupt
set_connection_parameter_value cpu_1.d_irq/fifo_1.out_irq irqNumber 17
add_connection cpu_1.d_irq jtag_uart_1.irq interrupt
set_connection_parameter_value cpu_1.d_irq/jtag_uart_1.irq irqNumber 5
add_connection cpu_1.d_irq timer_1.irq interrupt
set_connection_parameter_value cpu_1.d_irq/timer_1.irq irqNumber 2
add_connection cpu_2.d_irq fifo_0.in_irq interrupt
set_connection_parameter_value cpu_2.d_irq/fifo_0.in_irq irqNumber 16
add_connection cpu_2.d_irq fifo_0.out_irq interrupt
set_connection_parameter_value cpu_2.d_irq/fifo_0.out_irq irqNumber 15
add_connection cpu_2.d_irq fifo_1.in_irq interrupt
set_connection_parameter_value cpu_2.d_irq/fifo_1.in_irq irqNumber 18
add_connection cpu_2.d_irq fifo_1.out_irq interrupt
set_connection_parameter_value cpu_2.d_irq/fifo_1.out_irq irqNumber 17
add_connection cpu_2.d_irq jtag_uart_2.irq interrupt
set_connection_parameter_value cpu_2.d_irq/jtag_uart_2.irq irqNumber 5
add_connection cpu_2.d_irq timer_2.irq interrupt
set_connection_parameter_value cpu_2.d_irq/timer_2.irq irqNumber 2
add_connection cpu_3.d_irq fifo_0.in_irq interrupt
set_connection_parameter_value cpu_3.d_irq/fifo_0.in_irq irqNumber 16
add_connection cpu_3.d_irq fifo_0.out_irq interrupt
set_connection_parameter_value cpu_3.d_irq/fifo_0.out_irq irqNumber 15
add_connection cpu_3.d_irq fifo_1.in_irq interrupt
set_connection_parameter_value cpu_3.d_irq/fifo_1.in_irq irqNumber 18
add_connection cpu_3.d_irq fifo_1.out_irq interrupt
set_connection_parameter_value cpu_3.d_irq/fifo_1.out_irq irqNumber 17
add_connection cpu_3.d_irq jtag_uart_3.irq interrupt
set_connection_parameter_value cpu_3.d_irq/jtag_uart_3.irq irqNumber 5
add_connection cpu_3.d_irq timer_3.irq interrupt
set_connection_parameter_value cpu_3.d_irq/timer_3.irq irqNumber 2
add_connection cpu_4.d_irq fifo_0.in_irq interrupt
set_connection_parameter_value cpu_4.d_irq/fifo_0.in_irq irqNumber 16
add_connection cpu_4.d_irq fifo_0.out_irq interrupt
set_connection_parameter_value cpu_4.d_irq/fifo_0.out_irq irqNumber 15
add_connection cpu_4.d_irq fifo_1.in_irq interrupt
set_connection_parameter_value cpu_4.d_irq/fifo_1.in_irq irqNumber 18
add_connection cpu_4.d_irq fifo_1.out_irq interrupt
set_connection_parameter_value cpu_4.d_irq/fifo_1.out_irq irqNumber 17
add_connection cpu_4.d_irq jtag_uart_4.irq interrupt
set_connection_parameter_value cpu_4.d_irq/jtag_uart_4.irq irqNumber 5
add_connection cpu_4.d_irq timer_4.irq interrupt
set_connection_parameter_value cpu_4.d_irq/timer_4.irq irqNumber 2

# exported interfaces
add_interface clk clock sink
set_interface_property clk EXPORT_OF clk_0.clk_in
add_interface reset reset sink
set_interface_property reset EXPORT_OF clk_0.clk_in_reset
add_interface switches conduit end
set_interface_property switches EXPORT_OF switches.external_connection
add_interface leds_green conduit end
set_interface_property leds_green EXPORT_OF leds_green.external_connection
add_interface sdram_wire conduit end
set_interface_property sdram_wire EXPORT_OF sdram.wire
add_interface leds_red conduit end
set_interface_property leds_red EXPORT_OF leds_red.external_connection
add_interface hex3_hex0 conduit end
set_interface_property hex3_hex0 EXPORT_OF HEX3_HEX0.external_interface
add_interface hex7_hex4 conduit end
set_interface_property hex7_hex4 EXPORT_OF HEX7_HEX4.external_interface
add_interface buttons conduit end
set_interface_property buttons EXPORT_OF Buttons.external_interface
add_interface sram conduit end
set_interface_property sram EXPORT_OF sram.external_interface

set_interconnect_requirement {$system} qsys_mm.clockCrossingAdapter HANDSHAKE
set_interconnect_requirement {$system} qsys_mm.maxAdditionalLatency 1

save_system nios2_mpsoc.qsys
